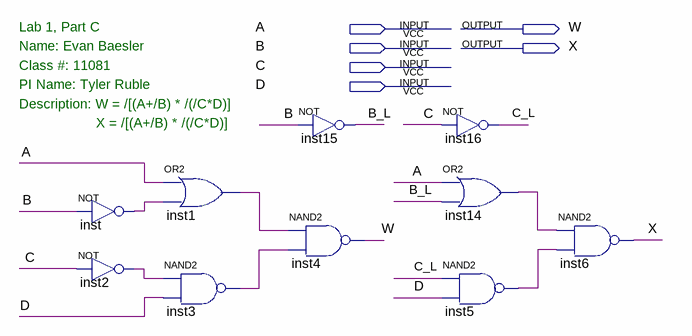
[diagram p0: schematic sheet]
// Quartus schematic lab1c.bdf as structural Verilog: 10 symbols, 6 pins
module lab1c (
  input  A,
  input  B,
  input  C,
  input  D,
  output W,
  output X
);

  wire B_L, C_L, inst1_out, inst2_out, inst3_out, inst5_out, inst14_out, inst_out;

  not inst (inst_out, B);
  not inst2 (inst2_out, C);
  or inst1 (inst1_out, A, inst_out);
  nand inst3 (inst3_out, inst2_out, D);
  not inst15 (B_L, B);
  nand inst4 (W, inst1_out, inst3_out);
  not inst16 (C_L, C);
  or inst14 (inst14_out, A, B_L);
  nand inst5 (inst5_out, C_L, D);
  nand inst6 (X, inst14_out, inst5_out);

  // Notes on the sheet:
  //   Lab 1, Part C
  //   Name: Evan Baesler
  //   Class #: 11081
  //   PI Name: Tyler Ruble
  //   Description: W = /[(A+/B) * /(/C*D)]
  //   X = /[(A+/B) * /(/C*D)]
endmodule
